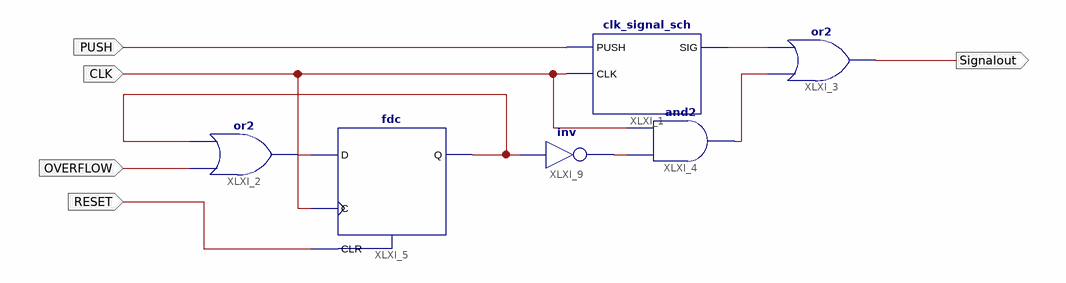
[diagram p0: schematic sheet 1]
// Xilinx ISE schematic BypassClk.sch (spartan3e) as structural Verilog: 6 symbols, 5 ports
module BypassClk (
  input  PUSH,
  input  OVERFLOW,
  input  CLK,
  input  RESET,
  output Signalout
);

  wire XLXN_1, XLXN_2, XLXN_3, XLXN_12, XLXN_14;

  fdc XLXI_5 (.C(CLK), .CLR(RESET), .D(XLXN_12), .Q(XLXN_1));
  not XLXI_9 (XLXN_2, XLXN_1);
  and XLXI_4 (XLXN_3, XLXN_2, CLK);
  or XLXI_3 (Signalout, XLXN_3, XLXN_14);
  clk_signal_sch XLXI_1 (.PUSH(PUSH), .CLK(CLK), .SIG(XLXN_14));
  or XLXI_2 (XLXN_12, OVERFLOW, XLXN_1);
endmodule
